# Altium schematic sheet DAPLink.SchDoc
size A4
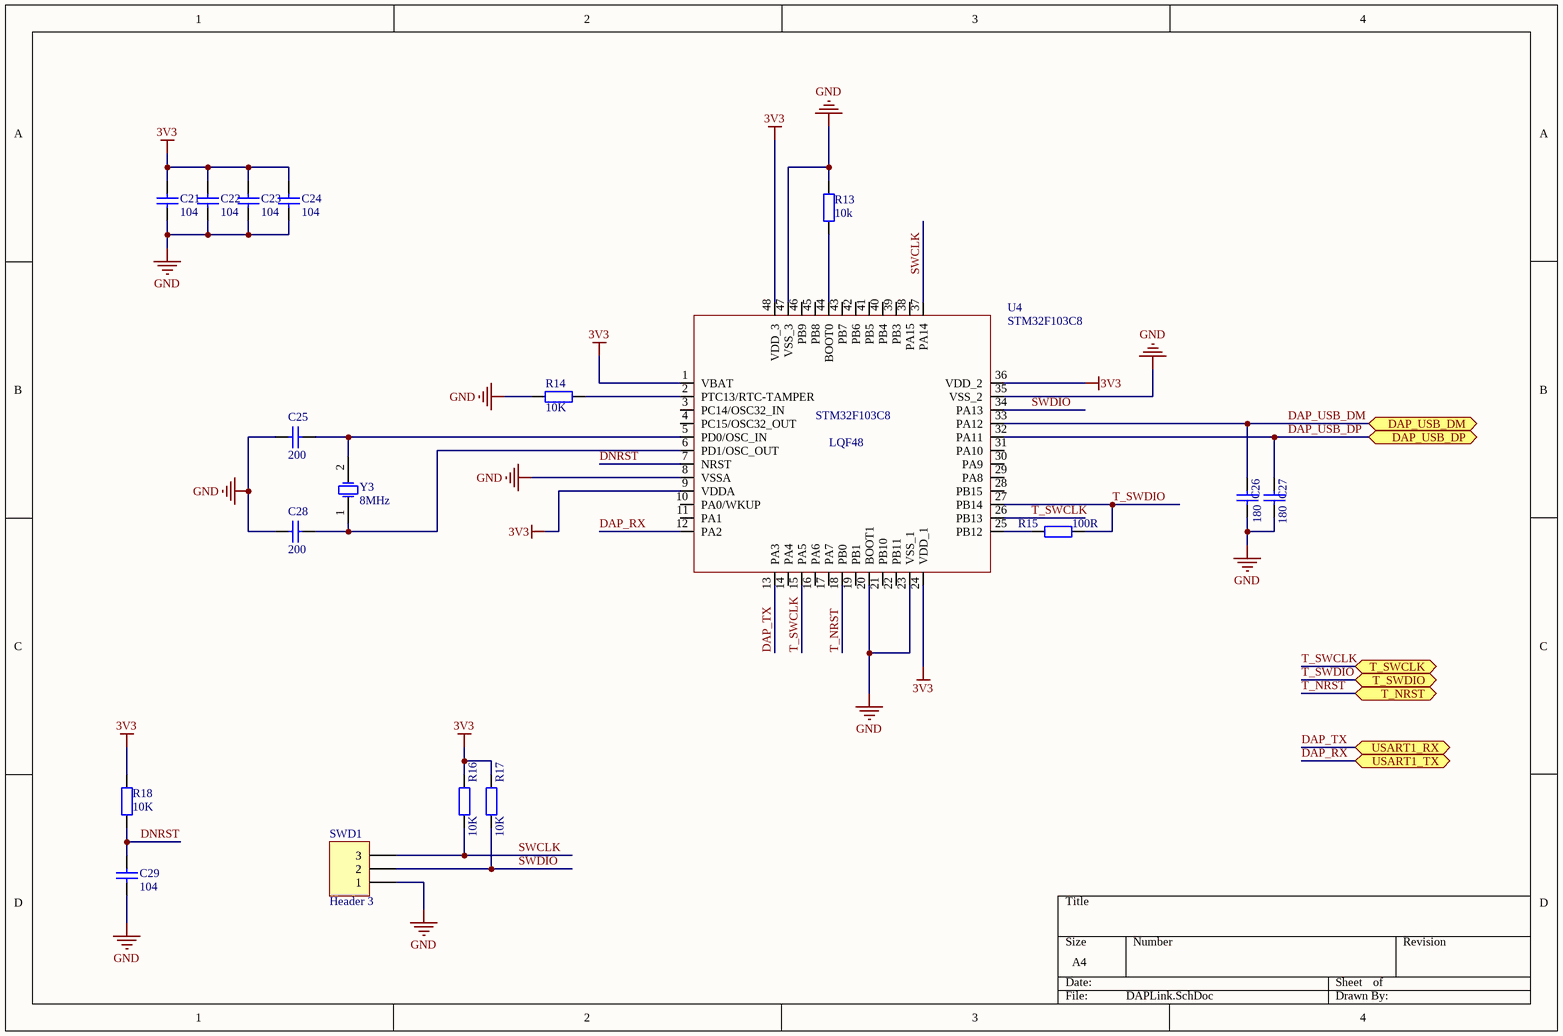
[diagram p0: DAPLink.SchDoc]

## Parts
C21  104  [C_SOP_0603]
C22  104  [C_SOP_0603]
C23  104  [C_SOP_0603]
C24  104  [C_SOP_0603]
C25  200  [C_SOP_0603]
C26  180  [C_SOP_0603]
C27  180  [C_SOP_0603]
C28  200  [C_SOP_0603]
C29  104  [C_SOP_0603]
R13  10k  [R_SMD_0603]
R14  10K  [R_SMD_0603]
R15  100R  [R_SMD_0603]
R16  10K  [R_SMD_0603]
R17  10K  [R_SMD_0603]
R18  10K  [R_SMD_0603]
SWD1  Header 3  [HDR1X3]
U4  STM32F103C8  [LQFP_48_7X7]
Y3  8MHz  [XTAL_SMD_49S]

## Ports
DAP_USB_DM (bidir), DAP_USB_DP (bidir), T_NRST (bidir), T_SWCLK (bidir), T_SWDIO (bidir), USART1_RX (bidir), USART1_TX (bidir)

## Nets
3V3: C21.2 C22.2 C23.2 C24.2 R16.2 R17.2 R18.2 U4.1(VBAT) U4.9(VDDA) U4.24(VDD_1) U4.36(VDD_2) U4.48(VDD_3)
GND: C21.1 C22.1 C23.1 C24.1 C25.1 C26.1 C27.1 C28.1 C29.1 R13.2 R14.1 SWD1.1 U4.8(VSSA) U4.20(BOOT1) U4.23(VSS_1) U4.35(VSS_2) U4.47(VSS_3)
DAP_RX: U4.12(PA2) ; port USART1_TX
DAP_TX: U4.13(PA3) ; port USART1_RX
DAP_USB_DM: C26.2 U4.33(PA12) ; port DAP_USB_DM
DAP_USB_DP: C27.2 U4.32(PA11) ; port DAP_USB_DP
DNRST: C29.2 R18.1 U4.7(NRST)
SWCLK: R16.1 SWD1.3 U4.37(PA14)
SWDIO: R17.1 SWD1.2 U4.34(PA13)
T_NRST: U4.18(PB0) ; port T_NRST
T_SWCLK: U4.15(PA5) U4.26(PB13) ; port T_SWCLK
T_SWDIO: R15.2 U4.27(PB14) ; port T_SWDIO
NetC25_2: C25.2 U4.5(PD0/OSC_IN) Y3.2(OSC2)
NetC28_2: C28.2 U4.6(PD1/OSC_OUT) Y3.1(OSC1)
NetR13_1: R13.1 U4.44(BOOT0)
NetR14_2: R14.2 U4.2(PTC13/RTC-TAMPER)
NetR15_1: R15.1 U4.25(PB12)

Not connected (* = marked no-connect by the designer): U4 3(PC14/OSC32_IN) 4(PC15/OSC32_OUT) 10(PA0/WKUP) 11(PA1) 14(PA4) 16(PA6) 17(PA7) 19(PB1) 21(PB10) 22(PB11) 28(PB15) 29(PA8) 30(PA9) 31(PA10) 38(PA15) 39(PB3) 40(PB4) 41(PB5) 42(PB6) 43(PB7) 45(PB8) 46(PB9)

## Notes on the sheet
- (in symbol STM32F103C8) LQF48

## Library data of the parts
C21-C29 = Cap: 电容_无极性
R13-R18 = Res: 电阻
SWD1 = Header 3: Header, 3-Pin; LatestRevisionDate: 17-Jul-2002; LatestRevisionNote: Re-released for DXP Platform.; Publisher: Altium Limited
U4 = STM32F103C8: ST-MCU
Y3 = XTAL_SMD